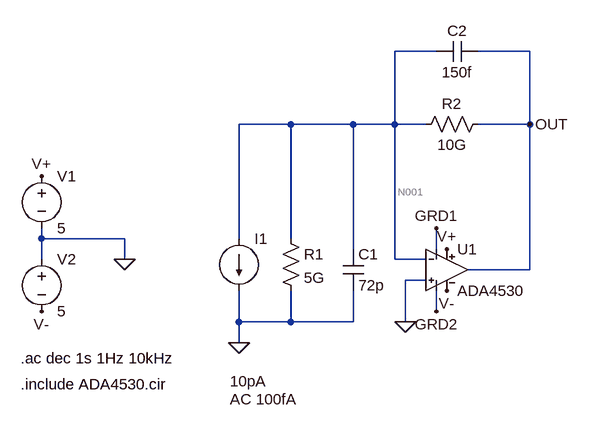
[diagram p0: schematic 005transimpedance_ada4530_ac_sweep.asc]
005transimpedance_ada4530_ac_sweep.asc, the LTspice schematic file:
Version 4
SHEET 1 880 680
WIRE 272 -144 208 -144
WIRE 416 -144 336 -144
WIRE 48 -32 -32 -32
WIRE 144 -32 48 -32
WIRE 208 -32 208 -144
WIRE 208 -32 144 -32
WIRE 256 -32 208 -32
WIRE 416 -32 416 -144
WIRE 416 -32 336 -32
WIRE -336 144 -336 128
WIRE -208 144 -336 144
WIRE -32 144 -32 -32
WIRE 48 144 48 -32
WIRE 144 160 144 -32
WIRE 272 160 272 128
WIRE -336 176 -336 144
WIRE -208 176 -208 144
WIRE 208 176 208 -32
WIRE 256 176 208 176
WIRE 416 192 416 -32
WIRE 416 192 320 192
WIRE 256 208 224 208
WIRE 272 256 272 224
WIRE -32 272 -32 224
WIRE 48 272 48 224
WIRE 48 272 -32 272
WIRE 144 272 144 224
WIRE 144 272 48 272
WIRE 224 272 224 208
WIRE -32 304 -32 272
FLAG -32 304 0
FLAG 224 272 0
FLAG -208 176 0
FLAG -336 48 V+
FLAG -336 256 V-
FLAG 288 160 V+
FLAG 416 -32 OUT
FLAG 272 128 GRD1
FLAG 272 256 GRD2
FLAG 288 224 V-
SYMBOL current -32 144 R0
WINDOW 123 -14 247 Left 2
WINDOW 39 0 0 Left 2
WINDOW 3 -14 219 Left 2
SYMATTR Value2 AC 100fA
SYMATTR InstName I1
SYMATTR Value 10pA
SYMBOL res 32 128 R0
SYMATTR InstName R1
SYMATTR Value 5G
SYMBOL cap 128 160 R0
SYMATTR InstName C1
SYMATTR Value 72p
SYMBOL res 352 -48 R90
WINDOW 0 0 56 VBottom 2
WINDOW 3 32 56 VTop 2
SYMATTR InstName R2
SYMATTR Value 10G
SYMBOL voltage -336 32 R0
WINDOW 123 0 0 Left 2
WINDOW 39 0 0 Left 2
SYMATTR InstName V1
SYMATTR Value 5
SYMBOL voltage -336 160 R0
WINDOW 123 0 0 Left 2
WINDOW 39 0 0 Left 2
SYMATTR InstName V2
SYMATTR Value 5
SYMBOL opamp_with_guards 288 128 R0
SYMATTR InstName U1
SYMATTR Value ADA4530
SYMBOL cap 336 -160 R90
WINDOW 0 0 32 VBottom 2
WINDOW 3 32 32 VTop 2
SYMATTR InstName C2
SYMATTR Value 150f
TEXT -368 328 Left 2 !.ac dec 1s 1Hz 10kHz
TEXT -368 368 Left 2 !.include ADA4530.cir

The netlist it stands for:
* 005transimpedance_ada4530_ac_sweep.asc
I1 N001 0 10pA AC 100fA
R1 N001 0 5G
C1 N001 0 72p
R2 OUT N001 10G
V1 V+ 0 5
V2 0 V- 5
XU1 0 N001 V+ V- OUT GRD1 GRD2 ADA4530  ; pins In+ In- V+ V- OUT GRD1 GRD2
C2 OUT N001 150f
.ac dec 1s 1Hz 10kHz
.include ADA4530.cir
.backanno
.end

* Results of the author's LTspice run, read from the files saved beside the schematic
* Operating Point, zero values left out:
*   V(n001) = -8.009 µV
*   V(out) = 99.98 mV
*   V(v+) = 5 V
*   V(v-) = -5 V
*   I(I1) = 10 pA
*   I(R2) = 9.998 pA
*   I(V2) = -901 µA
*   I(V1) = -901 µA
*   Ix(u1:N102) = 901 µA
*   Ix(u1:N103) = -901 µA
*   Ix(u1:N104) = -9.998 pA
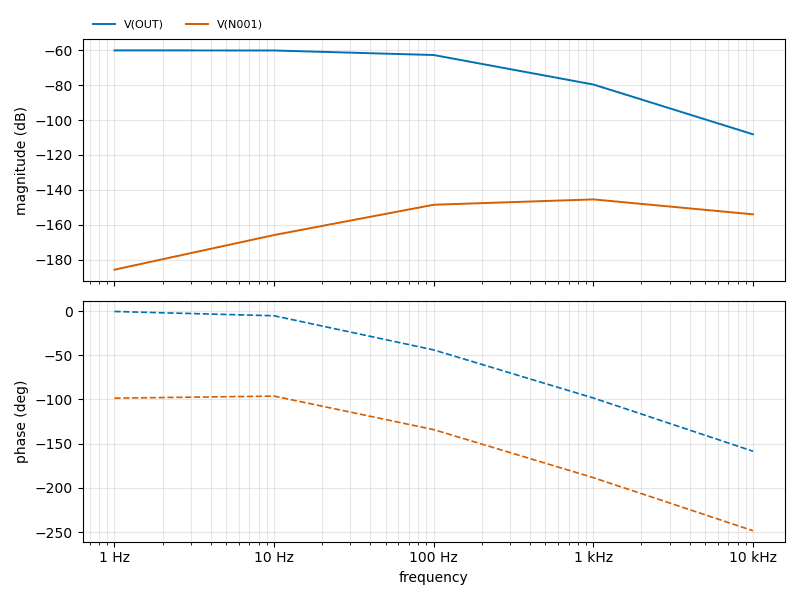
[diagram p1: AC Analysis of 005transimpedance_ada4530_ac_sweep.asc, plotted from the saved traces]
* AC Analysis, 1 run:
*   V(OUT): -60.00 dB at 1 Hz, -108.15 dB at 10 kHz, peak -60.00 dB at 1 Hz, 3 dB below the peak at 105 Hz
*   V(N001): -185.83 dB at 1 Hz, -154.07 dB at 10 kHz, peak -145.50 dB at 1 kHz, 3 dB below the peak at 104.7 Hz and 2.244 kHz